# Altium schematic sheet FlexEMG_v0r0_SF2-COMM.SchDoc
size A3
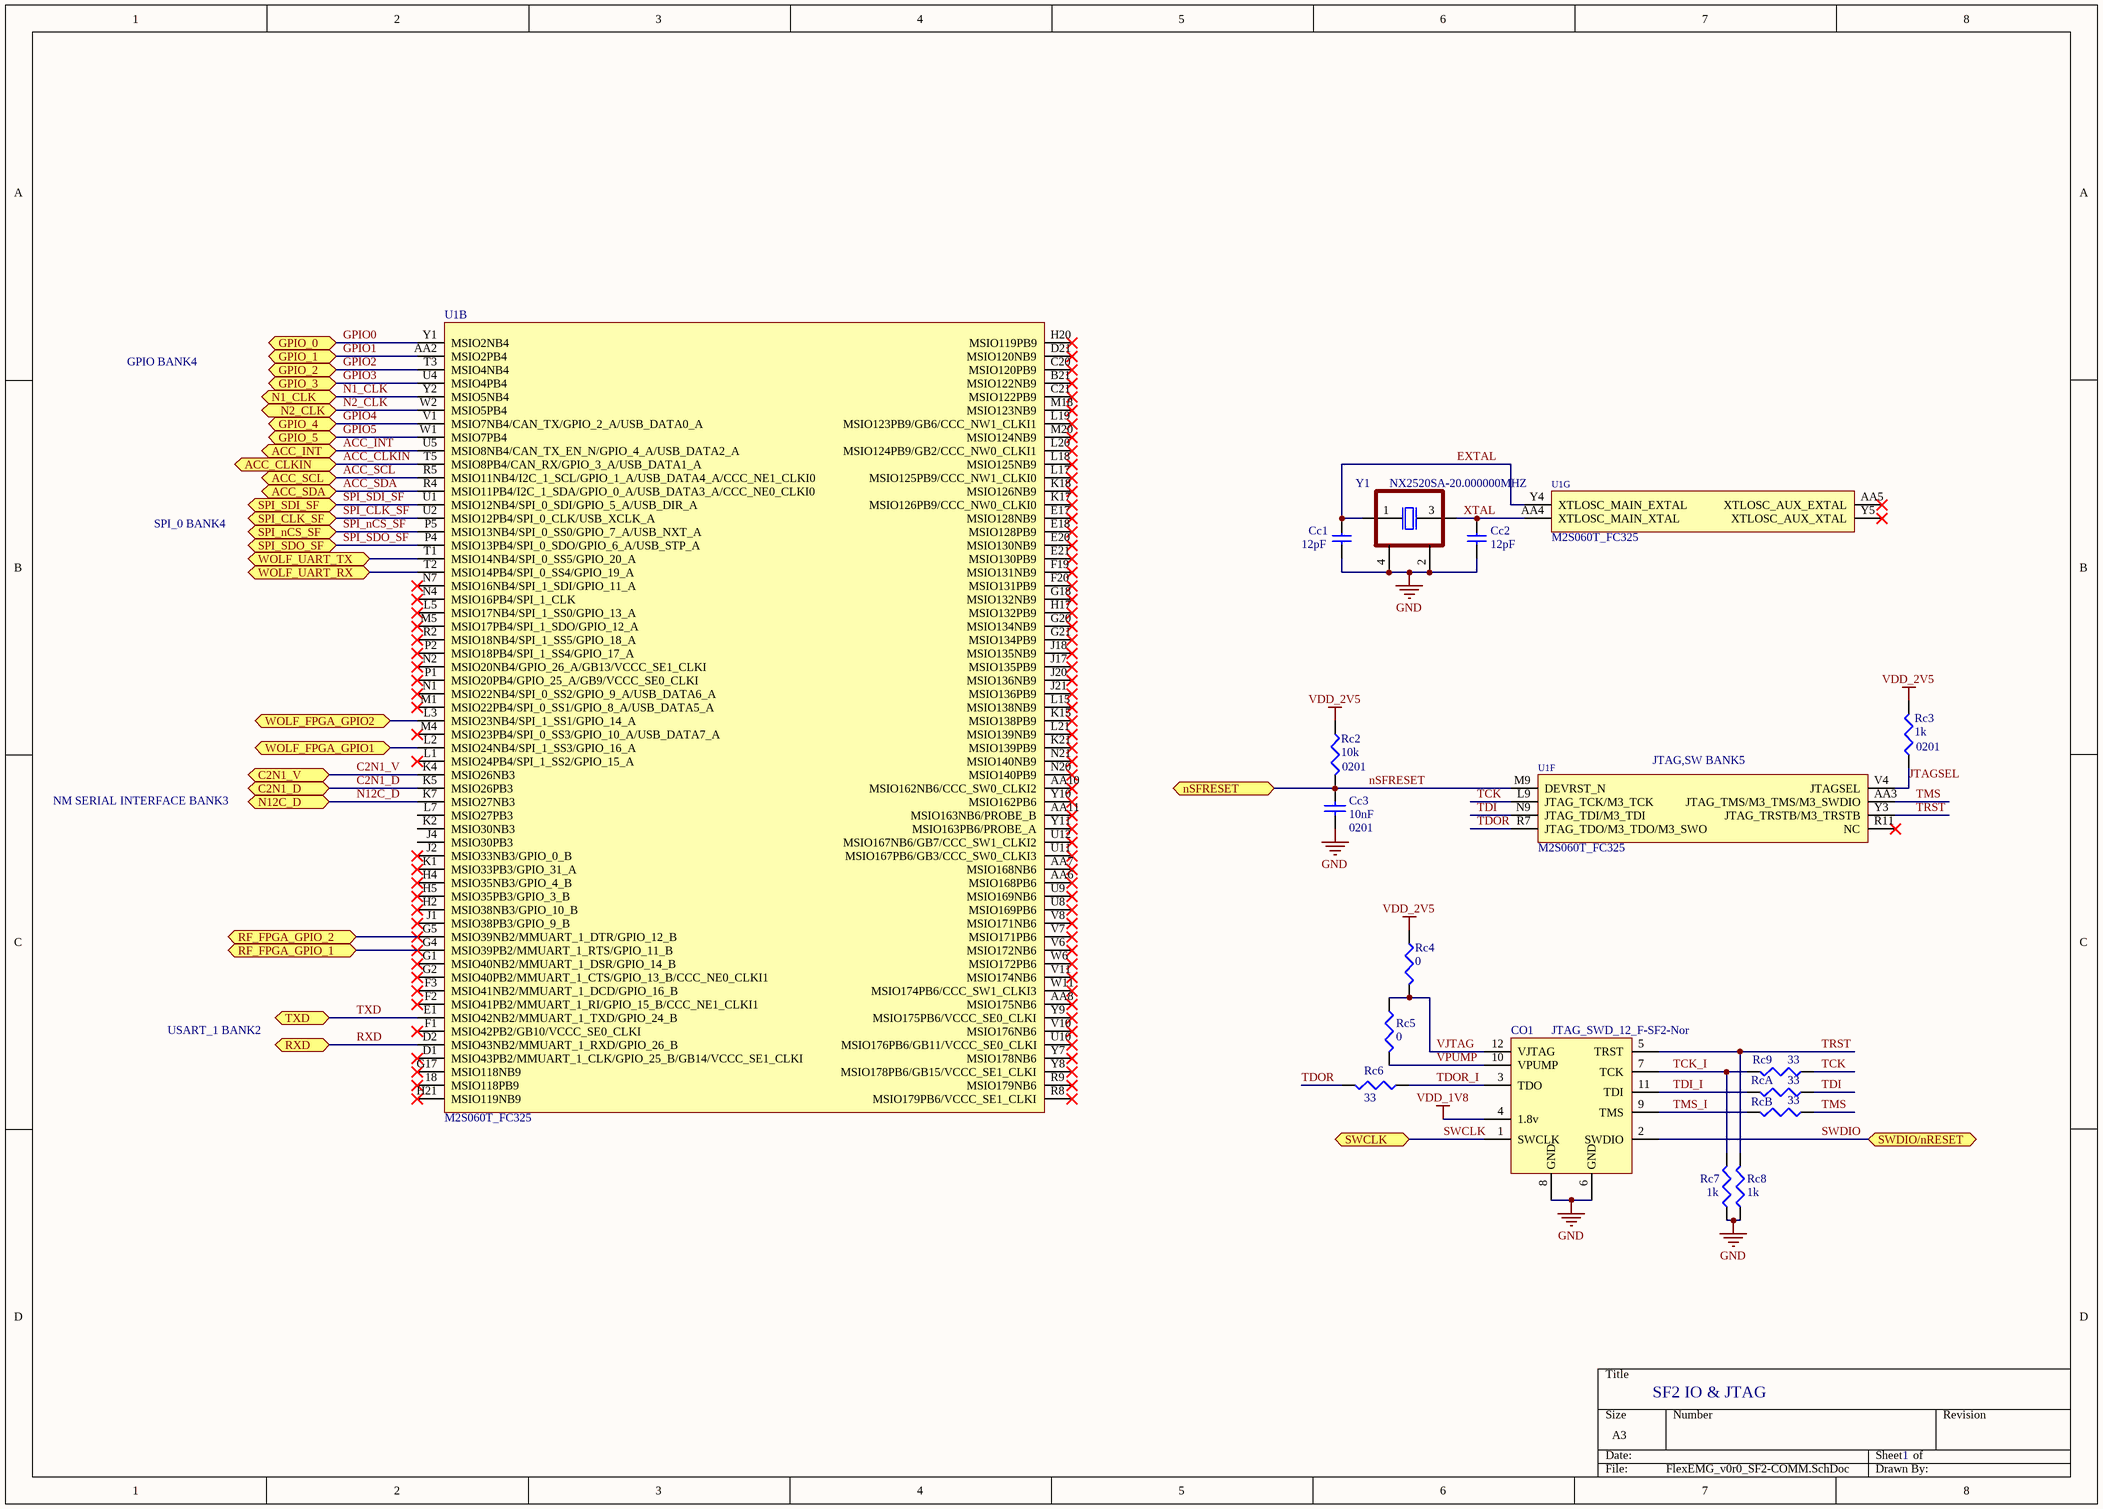
[diagram p0: FlexEMG_v0r0_SF2-COMM.SchDoc]

## Parts
Cc1  value 12pF  [c0402-Murata-GR]  (hidden comment: GRM1555C1H120FA01D)
Cc2  value 12pF  [c0402-Murata-GR]  (hidden comment: GRM1555C1H120FA01D)
Cc3  0201  value 10nF  [c0201-Murata-GR]
CO1  JTAG_SWD_12_F-SF2-Nor  [CONN_12-CLP]
Rc2  value 10k  Package: 0201  [0201_p]  (hidden comment: ERJ-1GEF1002C)
Rc3  value 1k  Package: 0201  [0201_p]  (hidden comment: ERJ-1GEF1001C)
Rc4  value 0  [0402_p]  (hidden comment: ERJ-2GE0R00X)
Rc5  value 0  [0402_p]  (hidden comment: ERJ-2GE0R00X)
Rc6  value 33  [0402_p]  (hidden comment: ERJ-PA2J330X)
Rc7  value 1k  [0402_p]  (hidden comment: ERJ-2RKF1001X)
Rc8  value 1k  [0402_p]  (hidden comment: ERJ-2RKF1001X)
Rc9  value 33  [0402_p]  (hidden comment: ERJ-PA2J330X)
RcA  value 33  [0402_p]  (hidden comment: ERJ-PA2J330X)
RcB  value 33  [0402_p]  (hidden comment: ERJ-PA2J330X)
U1  M2S060T_FC325  [MCSM-CS-325]  (parts B,F,G of 9)
Y1  NX2520SA-20.000000MHZ  [XOSC_4PIN]

## Ports
ACC_CLKIN, ACC_INT, ACC_SCL, ACC_SDA, C2N1_D (bidir), C2N1_V (bidir), GPIO_0, GPIO_1, GPIO_2, GPIO_3, GPIO_4, GPIO_5, N1_CLK (bidir), N2_CLK (bidir), N12C_D (bidir), nSFRESET (bidir), RF_FPGA_GPIO_1 (bidir), RF_FPGA_GPIO_2 (bidir), RXD (bidir), SPI_CLK_SF (bidir), SPI_nCS_SF (bidir), SPI_SDI_SF (bidir), SPI_SDO_SF (bidir), SWCLK (bidir), SWDIO/nRESET (bidir), TXD (bidir), WOLF_FPGA_GPIO1 (bidir), WOLF_FPGA_GPIO2 (bidir), WOLF_UART_RX (bidir), WOLF_UART_TX (bidir)

## Nets
GND: Cc1.1 Cc2.1 Cc3.1 CO1.6(GND) CO1.8(GND) Rc7.1 Rc8.1 Y1.2(GND) Y1.4(GND)
VDD_1V8: CO1.4(1.8v)
VDD_2V5: Rc2.1 Rc3.2 Rc4.1
ACC_CLKIN: U1.T5(MSIO8PB4/CAN_RX/GPIO_3_A/USB_DATA1_A) ; port ACC_CLKIN
ACC_INT: U1.U5(MSIO8NB4/CAN_TX_EN_N/GPIO_4_A/USB_DATA2_A) ; port ACC_INT
ACC_SCL: U1.R5(MSIO11NB4/I2C_1_SCL/GPIO_1_A/USB_DATA4_A/CCC_NE1_CLKI0) ; port ACC_SCL
ACC_SDA: U1.R4(MSIO11PB4/I2C_1_SDA/GPIO_0_A/USB_DATA3_A/CCC_NE0_CLKI0) ; port ACC_SDA
C2N1_D: U1.K5(MSIO26PB3) ; port C2N1_D
C2N1_V: U1.K4(MSIO26NB3) ; port C2N1_V
EXTAL: Cc1.2 U1.Y4(XTLOSC_MAIN_EXTAL) Y1.1(inp)
GPIO0: U1.Y1(MSIO2NB4) ; port GPIO_0
GPIO1: U1.AA2(MSIO2PB4) ; port GPIO_1
GPIO2: U1.T3(MSIO4NB4) ; port GPIO_2
GPIO3: U1.U4(MSIO4PB4) ; port GPIO_3
GPIO4: U1.V1(MSIO7NB4/CAN_TX/GPIO_2_A/USB_DATA0_A) ; port GPIO_4
GPIO5: U1.W1(MSIO7PB4) ; port GPIO_5
JTAGSEL: Rc3.1 U1.V4(JTAGSEL)
N1_CLK: U1.Y2(MSIO5NB4) ; port N1_CLK
N2_CLK: U1.W2(MSIO5PB4) ; port N2_CLK
N12C_D: U1.K7(MSIO27NB3) ; port N12C_D
nSFRESET: Cc3.2 Rc2.2 U1.M9(DEVRST_N) ; port nSFRESET
RF_FPGA_GPIO_1: U1.G4(MSIO39PB2/MMUART_1_RTS/GPIO_11_B) ; port RF_FPGA_GPIO_1
RF_FPGA_GPIO_2: U1.G5(MSIO39NB2/MMUART_1_DTR/GPIO_12_B) ; port RF_FPGA_GPIO_2
RXD: U1.D2(MSIO43NB2/MMUART_1_RXD/GPIO_26_B) ; port RXD
SPI_CLK_SF: U1.U2(MSIO12PB4/SPI_0_CLK/USB_XCLK_A) ; port SPI_CLK_SF
SPI_nCS_SF: U1.P5(MSIO13NB4/SPI_0_SS0/GPIO_7_A/USB_NXT_A) ; port SPI_nCS_SF
SPI_SDI_SF: U1.U1(MSIO12NB4/SPI_0_SDI/GPIO_5_A/USB_DIR_A) ; port SPI_SDI_SF
SPI_SDO_SF: U1.P4(MSIO13PB4/SPI_0_SDO/GPIO_6_A/USB_STP_A) ; port SPI_SDO_SF
SWCLK: CO1.1(SWCLK) ; port SWCLK
SWDIO: CO1.2(SWDIO) ; port SWDIO/nRESET
TCK: Rc9.1 U1.L9(JTAG_TCK/M3_TCK)
TCK_I: CO1.7(TCK) Rc7.2 Rc9.2
TDI: RcA.1 U1.N9(JTAG_TDI/M3_TDI)
TDI_I: CO1.11(TDI) RcA.2
TDOR: Rc6.2 U1.R7(JTAG_TDO/M3_TDO/M3_SWO)
TDOR_I: CO1.3(TDO) Rc6.1
TMS: RcB.1 U1.AA3(JTAG_TMS/M3_TMS/M3_SWDIO)
TMS_I: CO1.9(TMS) RcB.2
TRST: CO1.5(TRST) Rc8.2 U1.Y3(JTAG_TRSTB/M3_TRSTB)
TXD: U1.E1(MSIO42NB2/MMUART_1_TXD/GPIO_24_B) ; port TXD
VJTAG: CO1.12(VJTAG) Rc4.2 Rc5.1
VPUMP: CO1.10(VPUMP) Rc5.2
WOLF_FPGA_GPIO1: U1.L2(MSIO24NB4/SPI_1_SS3/GPIO_16_A) ; port WOLF_FPGA_GPIO1
WOLF_FPGA_GPIO2: U1.L3(MSIO23NB4/SPI_1_SS1/GPIO_14_A) ; port WOLF_FPGA_GPIO2
WOLF_UART_RX: U1.T2(MSIO14PB4/SPI_0_SS4/GPIO_19_A) ; port WOLF_UART_RX
WOLF_UART_TX: U1.T1(MSIO14NB4/SPI_0_SS5/GPIO_20_A) ; port WOLF_UART_TX
XTAL: Cc2.2 U1.AA4(XTLOSC_MAIN_XTAL) Y1.3(out)

Not connected (* = marked no-connect by the designer): U1 18(MSIO118PB9)* AA5(XTLOSC_AUX_EXTAL)* AA6(MSIO168PB6)* AA7(MSIO168NB6)* AA8(MSIO175NB6)* AA10(MSIO162NB6/CCC_SW0_CLKI2)* AA11(MSIO163NB6/PROBE_B)* B21(MSIO122NB9)* C20(MSIO120PB9)* C21(MSIO122PB9)* D1(MSIO43PB2/MMUART_1_CLK/GPIO_25_B/GB14/VCCC_SE1_CLKI)* D21(MSIO120NB9)* E17(MSIO128NB9)* E18(MSIO128PB9)* E20(MSIO130NB9)* E21(MSIO130PB9)* F1(MSIO42PB2/GB10/VCCC_SE0_CLKI)* F2(MSIO41PB2/MMUART_1_RI/GPIO_15_B/CCC_NE1_CLKI1)* F3(MSIO41NB2/MMUART_1_DCD/GPIO_16_B)* F19(MSIO131NB9)* F20(MSIO131PB9)* G1(MSIO40NB2/MMUART_1_DSR/GPIO_14_B)* G2(MSIO40PB2/MMUART_1_CTS/GPIO_13_B/CCC_NE0_CLKI1)* G17(MSIO118NB9)* G18(MSIO132NB9)* G20(MSIO134NB9)* G21(MSIO134PB9)* H2(MSIO38NB3/GPIO_10_B)* H4(MSIO35NB3/GPIO_4_B)* H5(MSIO35PB3/GPIO_3_B)* H17(MSIO132PB9)* H20(MSIO119PB9)* H21(MSIO119NB9)* J1(MSIO38PB3/GPIO_9_B)* J2(MSIO33NB3/GPIO_0_B)* J4(MSIO30PB3) J17(MSIO135PB9)* J18(MSIO135NB9)* J20(MSIO136NB9)* J21(MSIO136PB9)* K1(MSIO33PB3/GPIO_31_A)* K2(MSIO30NB3) K15(MSIO138PB9)* K17(MSIO126PB9/CCC_NW0_CLKI0)* K18(MSIO126NB9)* K21(MSIO139PB9)* L1(MSIO24PB4/SPI_1_SS2/GPIO_15_A)* L5(MSIO17NB4/SPI_1_SS0/GPIO_13_A)* L7(MSIO27PB3) L15(MSIO138NB9)* L17(MSIO125PB9/CCC_NW1_CLKI0)* L18(MSIO125NB9)* L19(MSIO123PB9/GB6/CCC_NW1_CLKI1)* L20(MSIO124PB9/GB2/CCC_NW0_CLKI1)* L21(MSIO139NB9)* M1(MSIO22PB4/SPI_0_SS1/GPIO_8_A/USB_DATA5_A)* M4(MSIO23PB4/SPI_0_SS3/GPIO_10_A/USB_DATA7_A)* M5(MSIO17PB4/SPI_1_SDO/GPIO_12_A)* M18(MSIO123NB9)* M20(MSIO124NB9)* N1(MSIO22NB4/SPI_0_SS2/GPIO_9_A/USB_DATA6_A)* N2(MSIO20NB4/GPIO_26_A/GB13/VCCC_SE1_CLKI)* N4(MSIO16PB4/SPI_1_CLK)* N7(MSIO16NB4/SPI_1_SDI/GPIO_11_A)* N20(MSIO140PB9)* N21(MSIO140NB9)* P1(MSIO20PB4/GPIO_25_A/GB9/VCCC_SE0_CLKI)* P2(MSIO18PB4/SPI_1_SS4/GPIO_17_A)* R2(MSIO18NB4/SPI_1_SS5/GPIO_18_A)* R8(MSIO179PB6/VCCC_SE1_CLKI)* R9(MSIO179NB6)* R11(NC)* U8(MSIO169PB6)* U9(MSIO169NB6)* U10(MSIO176PB6/GB11/VCCC_SE0_CLKI)* U11(MSIO167PB6/GB3/CCC_SW0_CLKI3)* U12(MSIO167NB6/GB7/CCC_SW1_CLKI2)* V6(MSIO172NB6)* V7(MSIO171PB6)* V8(MSIO171NB6)* V10(MSIO176NB6)* V11(MSIO174NB6)* W6(MSIO172PB6)* W11(MSIO174PB6/CCC_SW1_CLKI3)* Y5(XTLOSC_AUX_XTAL)* Y7(MSIO178NB6)* Y8(MSIO178PB6/GB15/VCCC_SE1_CLKI)* Y9(MSIO175PB6/VCCC_SE0_CLKI)* Y10(MSIO162PB6)* Y11(MSIO163PB6/PROBE_A)*

## Notes on the sheet
- GPIO BANK4
- SPI_0 BANK4
- (near U1) JTAG,SW BANK5
- NM SERIAL INTERFACE BANK3
- USART_1 BANK2
- SF2 IO & JTAG
- 1

## Library data of the parts
Cc1 Cc2 = CAP_0402: CAP CER 12PF 50V NP0 0402; Manufacturer: Murata; Supplier: Digikey; Manufacturer PN: GRM1555C1H120FA01D; Supplier PN: 490-6196-1-ND
Cc3 = Cap: CAP CER 10000PF 25V X5R 0201; Manufacturer: Murata; Manufacturer PN: GRM033R61E103KA12D; Supplier: Digikey; Supplier PN: 490-7194-1-ND
CO1 = JTAG_SWD_12_F-SF2-Nor: 12 pin female JTAG/SWD header for SmartFusion2 and Nordic; Manufacturer: Samtec; Manufacturer PN: CLP-106-02-x-D; Supplier: Digikey; Supplier PN: SAM1153-06-ND
Rc2 = Resistor: RES SMD 10K OHM 1% 1/20W 0201; Manufacturer: Panasonic; Manufacturer PN: ERJ-1GEF1002C; Supplier: Digikey; Supplier P/N: P10.0KABCT-ND; Power: 1/20W
Rc3 = Resistor: RES SMD 1K OHM 1% 1/20W 0201; Manufacturer: Panasonic; Manufacturer PN: ERJ-1GEF1001C; Supplier: Digikey; Supplier P/N: P1.00KABCT-ND; Power: 1/20W
Rc4 Rc5 = Resistor: RES SMD 0.0OHM JUMPER 1/10W 0402; Manufacturer: Panasonic; Manufacturer PN: ERJ-2GE0R00X; Supplier: Digikey; Power: 1/10W; Supplier P/N: P0.0JCT-ND; Package: 0402
Rc6 Rc9 RcA RcB = Resistor: RES SMD 33 OHM 1% 1/10W 0402; Manufacturer: Panasonic; Power: 1/5W; Manufacturer PN: ERJ-PA2J330X; Supplier: Digikey; Supplier P/N: P17184CT-ND; Package: 0402
Rc7 Rc8 = Resistor: RES SMD 1K OHM 1% 1/10W 0402; Manufacturer: Panasonic; Manufacturer PN: ERJ-2RKF1001X; Supplier: Digikey; Supplier P/N: P1.00KLCT-ND; Power: 1/10W; Package: 0402
U1 = M2S060T_FC325: SmartFusion2; Manufacturer PN: M2S060T-CS325; Manufacturer: Microsemi; Supplier: Future; Supplier PN: M2S060T-FCSG325I
Y1 = XOSC: CRYSTAL 20.0000MHZ 10PF SMD; Manufacturer: NDK; Supplier PN: 644-1060-6-ND; Supplier: Digikey; Manufacturer PN: NX2520SA-20.000000MHZ